# EAGLE design nine_poke_i2c (EAGLE 6.6.0)
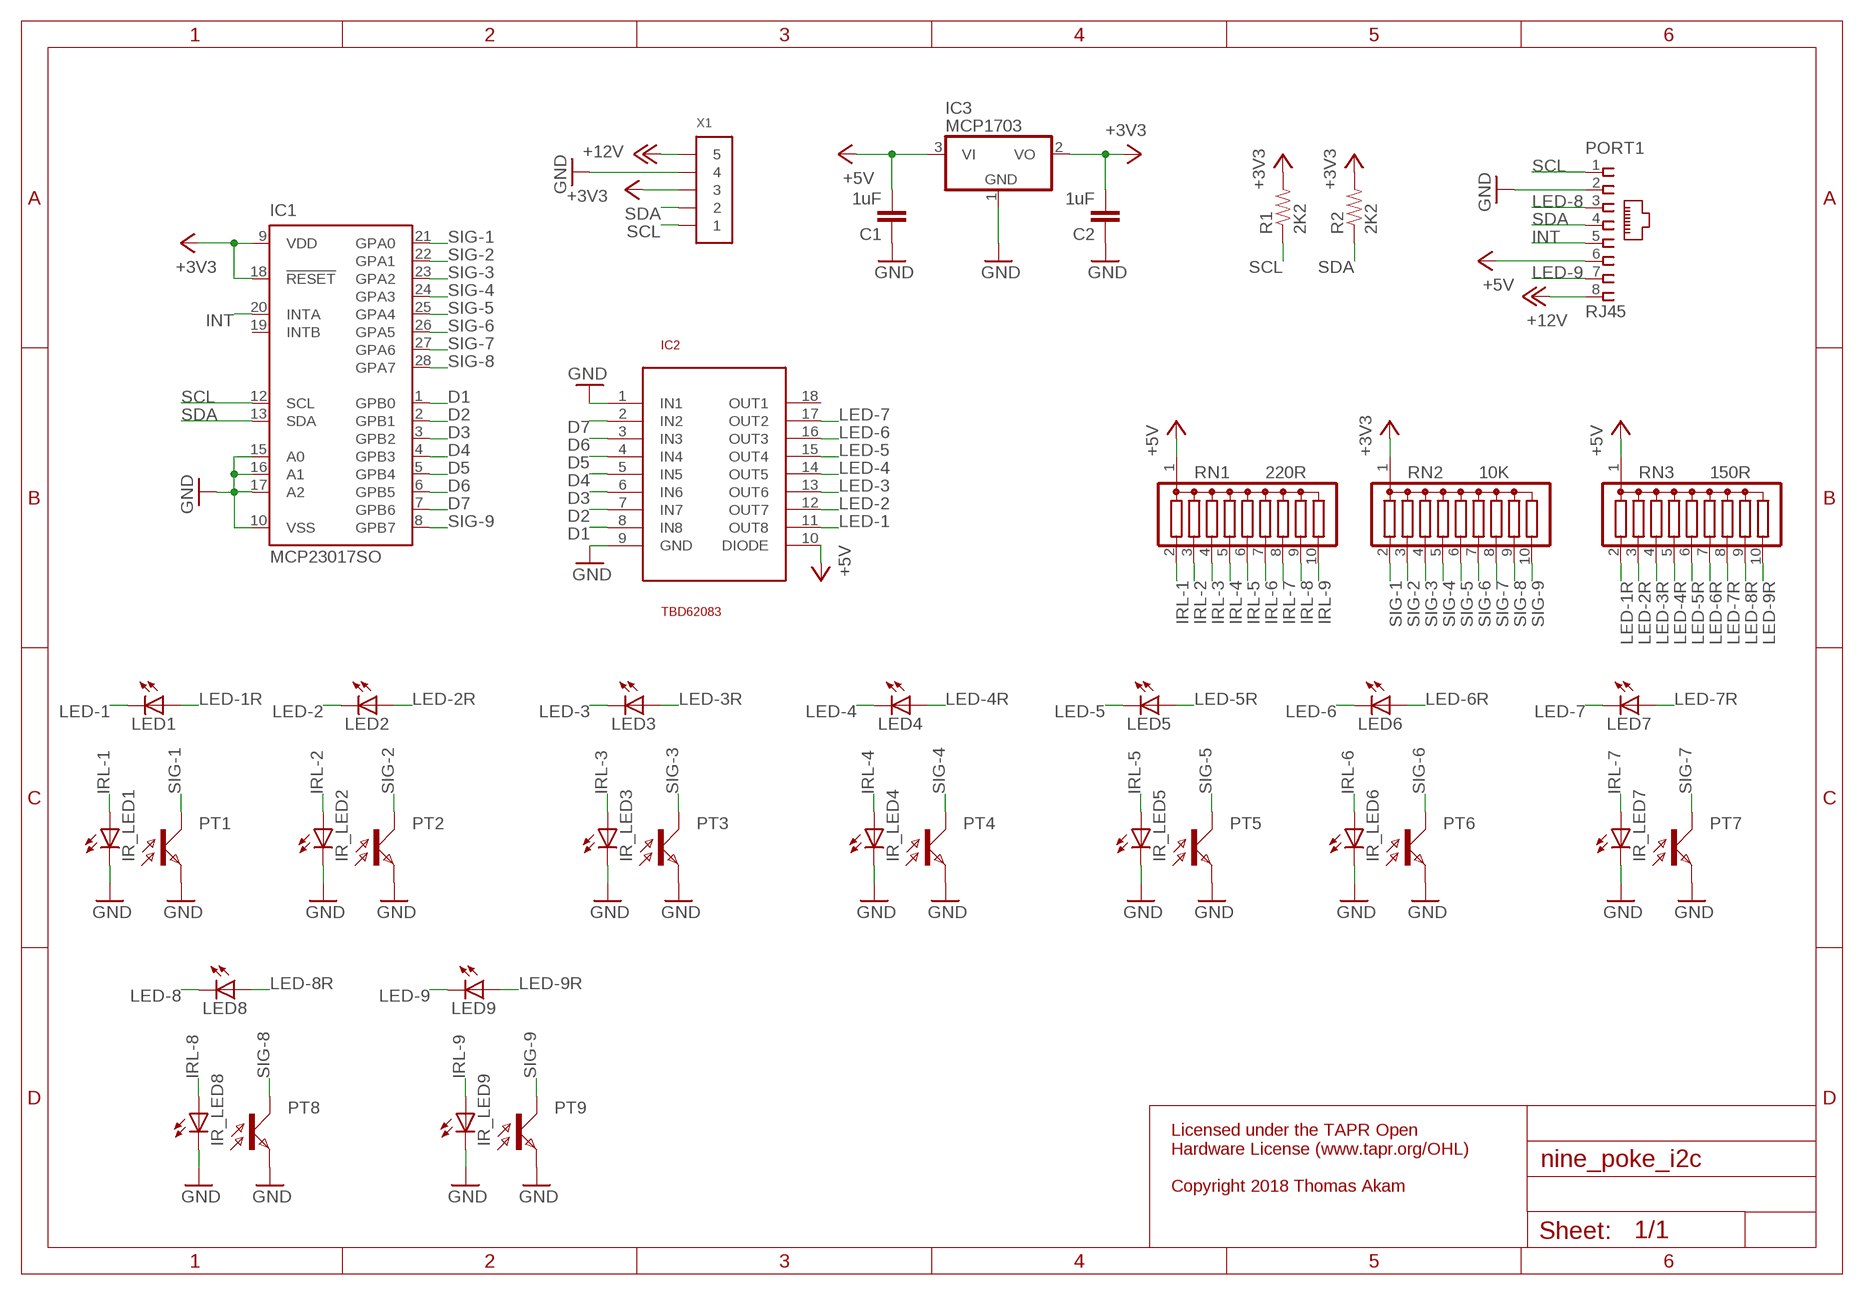
[diagram p0: schematic, sheet 1]

## Parts
C1  1uF  C-EUC0805  [C0805]
C2  1uF  C-EUC0805  [C0805]
IC1  MCP23017SO  [SO28W]
IC2  TBD62083  ULN2803  [SO18L]
IC3  MCP1703  MCP1703CB  [SOT23]
IR_LED1  LEDIRL80A  [IRL80A]
IR_LED2  LEDIRL80A  [IRL80A]
IR_LED3  LEDIRL80A  [IRL80A]
IR_LED4  LEDIRL80A  [IRL80A]
IR_LED5  LEDIRL80A  [IRL80A]
IR_LED6  LEDIRL80A  [IRL80A]
IR_LED7  LEDIRL80A  [IRL80A]
IR_LED8  LEDIRL80A  [IRL80A]
IR_LED9  LEDIRL80A  [IRL80A]
LED1  LEDSML0805  [SML0805]
LED2  LEDSML0805  [SML0805]
LED3  LEDSML0805  [SML0805]
LED4  LEDSML0805  [SML0805]
LED5  LEDSML0805  [SML0805]
LED6  LEDSML0805  [SML0805]
LED7  LEDSML0805  [SML0805]
LED8  LEDSML0805  [SML0805]
LED9  LEDSML0805  [SML0805]
PORT1  RJ45  RJ45VERTICAL  [RJ45-NO-SHIELD-VERTICAL]
PT1  LPT80A  [LPT80A]
PT2  LPT80A  [LPT80A]
PT3  LPT80A  [LPT80A]
PT4  LPT80A  [LPT80A]
PT5  LPT80A  [LPT80A]
PT6  LPT80A  [LPT80A]
PT7  LPT80A  [LPT80A]
PT8  LPT80A  [LPT80A]
PT9  LPT80A  [LPT80A]
R1  2K2  0.3OHM-1/8W-1%(0805)  [0805]
R2  2K2  0.3OHM-1/8W-1%(0805)  [0805]
RN1  220R  G09R  [SIL10]
RN2  10K  G09R  [SIL10]
RN3  150R  G09R  [SIL10]
X1  CONN_5-1-53398  [PB-53398-05]

## Nets
+3V3: C2.2 IC1.9(VDD) IC1.18(!RESET) IC3.2(VO) R1.2 R2.2 RN2.1 X1.3
+5V: C1.2 IC2.10(DIODE) IC3.3(VI) PORT1.6 RN1.1 RN3.1
+12V: PORT1.8 X1.5
D1: IC1.1(GPB0) IC2.8(IN8)
D2: IC1.2(GPB1) IC2.7(IN7)
D3: IC1.3(GPB2) IC2.6(IN6)
D4: IC1.4(GPB3) IC2.5(IN5)
D5: IC1.5(GPB4) IC2.4(IN4)
D6: IC1.6(GPB5) IC2.3(IN3)
D7: IC1.7(GPB6) IC2.2(IN2)
GND: C1.1 C2.1 IC1.10(VSS) IC1.15(A0) IC1.16(A1) IC1.17(A2) IC2.1(IN1) IC2.9(GND) IC3.1(GND) IR_LED1.K(C) IR_LED2.K(C) IR_LED3.K(C) IR_LED4.K(C) IR_LED5.K(C) IR_LED6.K(C) IR_LED7.K(C) IR_LED8.K(C) IR_LED9.K(C) PORT1.2 PT1.E PT2.E PT3.E PT4.E PT5.E PT6.E PT7.E PT8.E PT9.E X1.4
INT: IC1.20(INTA) PORT1.5
IRL-1: IR_LED1.A RN1.2
IRL-2: IR_LED2.A RN1.3
IRL-3: IR_LED3.A RN1.4
IRL-4: IR_LED4.A RN1.5
IRL-5: IR_LED5.A RN1.6
IRL-6: IR_LED6.A RN1.7
IRL-7: IR_LED7.A RN1.8
IRL-8: IR_LED8.A RN1.9
IRL-9: IR_LED9.A RN1.10
LED-1: IC2.11(OUT8) LED1.C
LED-1R: LED1.A RN3.2
LED-2: IC2.12(OUT7) LED2.C
LED-2R: LED2.A RN3.3
LED-3: IC2.13(OUT6) LED3.C
LED-3R: LED3.A RN3.4
LED-4: IC2.14(OUT5) LED4.C
LED-4R: LED4.A RN3.5
LED-5: IC2.15(OUT4) LED5.C
LED-5R: LED5.A RN3.6
LED-6: IC2.16(OUT3) LED6.C
LED-6R: LED6.A RN3.7
LED-7: IC2.17(OUT2) LED7.C
LED-7R: LED7.A RN3.8
LED-8: LED8.C PORT1.3
LED-8R: LED8.A RN3.9
LED-9: LED9.C PORT1.7
LED-9R: LED9.A RN3.10
SCL: IC1.12(SCL) PORT1.1 R1.1 X1.1
SDA: IC1.13(SDA) PORT1.4 R2.1 X1.2
SIG-1: IC1.21(GPA0) PT1.C RN2.2
SIG-2: IC1.22(GPA1) PT2.C RN2.3
SIG-3: IC1.23(GPA2) PT3.C RN2.4
SIG-4: IC1.24(GPA3) PT4.C RN2.5
SIG-5: IC1.25(GPA4) PT5.C RN2.6
SIG-6: IC1.26(GPA5) PT6.C RN2.7
SIG-7: IC1.27(GPA6) PT7.C RN2.8
SIG-8: IC1.28(GPA7) PT8.C RN2.9
SIG-9: IC1.8(GPB7) PT9.C RN2.10
Unconnected: IC1.19(INTB) IC2.18(OUT1)

## Notes on the sheet
- Licensed under the TAPR Open
  Hardware License (www.tapr.org/OHL)
  
  Copyright 2018 Thomas Akam

## Library data of the parts
C1 C2 = rcl:C-EU: CAPACITOR, European symbol
IC1 = microchip:MCP23017: http://ww1.microchip.com/downloads/en/DeviceDoc/21952a.pdf Source: http://ww1.microchip.com/downloads/en/DeviceDoc/21952a.pdf; MF: MICROCHIP; MPN: MCP23017-E/SO; OC_FARNELL: 1332087; OC_NEWARK: 31K2958
IC2 = uln2803:ULN2803
IC3 = linear:MCP1703: 250 mA, 16V, Low Quiescent Current LDO Regulator Source: http://ww1.microchip.com/downloads/en/DeviceDoc/22049b.pdf
IR_LED1-IR_LED9 LED1-LED9 = led:LED: LED OSRAM: - CHIPLED LG R971, LG N971, LY N971, LG Q971, LY Q971, LO R971, LY R971 LH N974, LH R974 LS Q976, LO Q976, LY Q976 LO Q996 - Hyper CHIPLED LW Q18S LB Q993, LB Q99A, LB R99A - SideLED LS A670, LO A670, LY A670, LG A670, LP A670 LB A673, LV A673, LT A673, LW A673 LH A674 LY A675 LS A676, LA A676, LO A676, LY A676, LW A676 LS A679, LY A679, LG A679 - Hyper Micro SIDELED® LS Y876, LA Y876, LO Y876, LY Y876 LT Y87S - SmartLED LW L88C, LW L88S LB L89C, LB L89S, LG L890 LS L89K, LO L89K, LY L89K LS L896, LA L896, LO L896, LY L896 - TOPLED LS T670, LO T670, LY T670, LG T670, LP T670 LSG T670, LSP T670, LSY T670, LOP T670, LYG T670 LG T671, LOG T671, LSG T671 LB T673, LV T673, LT T673, LW T673 LH T674 LS T676, LA T676, LO T676, LY T676, LB T676, LH T676, LSB T676, LW T676 LB T67C, LV T67C, LT T67C, LS T67K, LO T67K, LY T67K, LW E67C LS E67B, LA E67B, LO E67B, LY E67B, LB E67C, LV E67C, LT E67C LW T67C LS T679, LY T679, LG T679 LS T770, LO T770, LY T770, LG T770, LP T770 LB T773, LV T773, LT T773, LW T773 LH T774 LS E675, LA E675, LY E675, LS T675 LS T776, LA T776, LO T776, LY T776, LB T776 LHGB T686 LT T68C, LB T68C - Hyper Mini TOPLED® LB M676 - Mini TOPLED Santana® LG M470 LS M47K, LO M47K, LY M47K Source: http://www.osram.convergy.de LUXEON: - LUMILED® LXK2-PW12-R00, LXK2-PW12-S00, LXK2-PW14-U00, LXK2-PW14-V00 LXK2-PM12-R00, LXK2-PM12-S00, LXK2-PM14-U00 LXK2-PE12-Q00, LXK2-PE12-R00, LXK2-PE12-S00, LXK2-PE14-T00, LXK2-PE14-U00 LXK2-PB12-K00, LXK2-PB12-L00, LXK2-PB12-M00, LXK2-PB14-N00, LXK2-PB14-P00, LXK2-PB14-Q00 LXK2-PR12-L00, LXK2-PR12-M00, LXK2-PR14-Q00, LXK2-PR14-R00 LXK2-PD12-Q00, LXK2-PD12-R00, LXK2-PD12-S00 LXK2-PH12-R00, LXK2-PH12-S00 LXK2-PL12-P00, LXK2-PL12-Q00, LXK2-PL12-R00 Source: www.luxeon.com KINGBRIGHT: KA-3528ASYC Source: www.kingbright.com
PORT1 = con-tycoelectronics-vertical_RJ45:RJ45: CORCOM Modular RJ Jacks No Shield Source: www.tycoelectronics.com .. ENG_DS_1654001_1099_RJ_L_0507.pdf
PT1-PT9 = opto-trans-siemens:LPT80A: PHOTO TRANSISTOR; OC_FARNELL: unknown; OC_NEWARK: unknown
R1 R2 = SparkFun-Resistors:0.3OHM-1/8W-1%(0805): RES-11622; PROD_ID: RES-11622; VALUE: 0.3
RN1-RN3 = resistor-sil:G09R: SIL RESISTOR; OC_FARNELL: unknown; OC_NEWARK: unknown
X1 = pel_molex:CONN_5-1

## Board
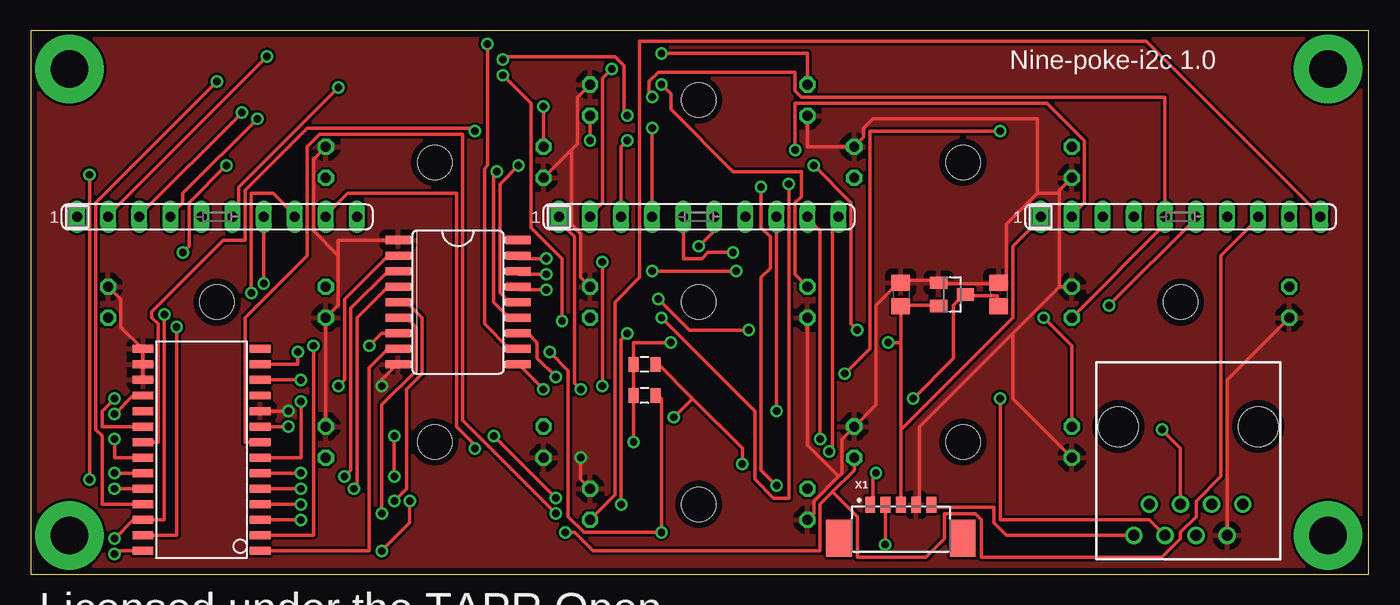
[diagram p1: board, top side]
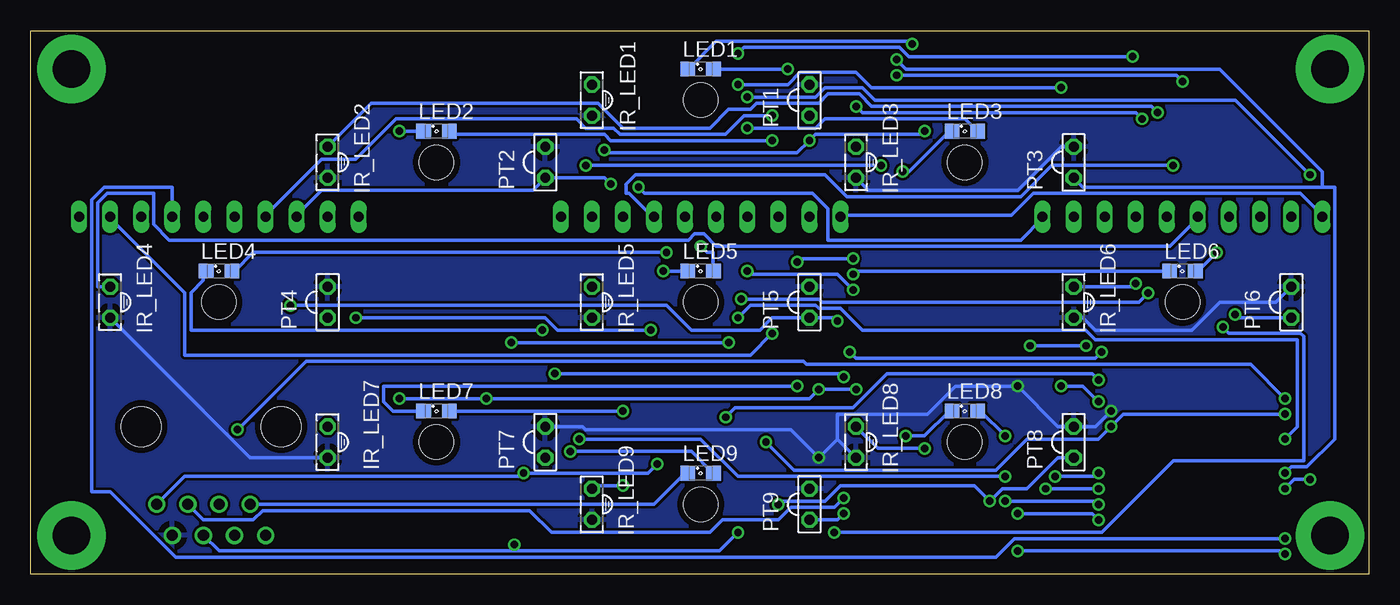
[diagram p2: board, bottom side, seen from below]

Size 109.38 x 44.41 mm. Coordinates in mm from the lower left corner, seen from the top.
Outline: 0,0 109.38,0 109.38,44.41 0,44.41 0,0
Copper layers (1*16): Top 0.035mm / dielectric 1.5mm / Bottom 0.035mm
Design rules "default *": minimum track width 12mil, minimum drill 24mil, track to track 8mil, track to pad 8mil, pad to pad 8mil, via to via 8mil, smd to smd 8mil, copper to edge 20mil, drill to drill 8mil, minimum pad ring 10mil, minimum via ring 8mil, stop-mask expansion 4mil, vias tented up to drill 0mil, thermal gap 20mil
Holes 2.8 mm at 54.61,38.73 76.2,33.66 33.02,33.66 93.98,22.23 54.61,22.23 15.24,22.23 76.2,10.79 33.02,10.79 54.61,5.71
vRestrict: area 68.5,18.9 to 82.2,24.3; area 10.2,0.6 to 17.8,18.5; area 31,15.6 to 38.6,27.4; area 12.7,29.8 to 17.1,31.1; area 52.1,29.8 to 56.5,31.1; area 91.4,29.8 to 94.6,31.1; area 80,40 to 99.1,42.5; area 48.3,12.7 to 55.9,17.8

### Footprints (pad centres in the part's own frame; a part is rotated, then mirrored left to right if it is on the bottom)
C0805 = smd 1.3 x 1.5: 1 -0.95,0; 2 0.95,0
SO28W = smd 0.65 x 1.7: 1 -7.62,-4.78; 2 -6.35,-4.78; 3 -5.08,-4.78; 4 -3.81,-4.78; 5 -2.54,-4.78; 6 -1.27,-4.78; 7 0,-4.78; 8 1.27,-4.78; 9 2.54,-4.78; 10 3.81,-4.78; 11 5.08,-4.78; 12 6.35,-4.78; 13 7.62,-4.78; 14 8.89,-4.78; 15 8.89,4.78; 16 7.62,4.78; 17 6.35,4.78; 18 5.08,4.78; 19 3.81,4.78; 20 2.54,4.78; 21 1.27,4.78; 22 0,4.78; 23 -1.27,4.78; 24 -2.54,4.78; 25 -3.81,4.78; 26 -5.08,4.78; 27 -6.35,4.78; 28 -7.62,4.78
SO18L = smd 0.66 x 2.032: 1 -5.08,-4.902; 2 -3.81,-4.902; 3 -2.54,-4.902; 4 -1.27,-4.902; 5 0,-4.902; 6 1.27,-4.902; 7 2.54,-4.902; 8 3.81,-4.902; 9 5.08,-4.902; 10 5.08,4.902; 11 3.81,4.902; 12 2.54,4.902; 13 1.27,4.902; 14 0,4.902; 15 -1.27,4.902; 16 -2.54,4.902; 17 -3.81,4.902; 18 -5.08,4.902
SOT23 = smd 1 x 1.4: 1 -0.95,-1.1; 2 0.95,-1.1; 3 0,1.1
IRL80A = drill 0.813 octagon: A 0,-1.27; K 0,1.27
SML0805 = smd 1.2 x 1.2: A 1.05,0; C -1.05,0
RJ45-NO-SHIELD-VERTICAL = drill 0.9 pad 1.4: 1 -4.445,5.08; 2 -3.175,7.62; 3 -1.905,5.08; 4 -0.635,7.62; 5 0.635,5.08; 6 1.905,7.62; 7 3.175,5.08; 8 4.445,7.62 | hole 3.251: -5.715,-1.27; 5.715,-1.27
LPT80A = drill 0.813 octagon: C 0,-1.27; E 0,1.27
0805 = smd 0.8 x 1.2: 1 -0.9,0; 2 0.9,0
SIL10 = drill 0.813 long: 1 -11.43,0; 2 -8.89,0; 3 -6.35,0; 4 -3.81,0; 5 -1.27,0; 6 1.27,0; 7 3.81,0; 8 6.35,0; 9 8.89,0; 10 11.43,0
PB-53398-05 = smd 0.8 x 1.3: 1 -2.5,1.25; 2 -1.25,1.25; 3 0,1.25; 4 1.25,1.25; 5 2.5,1.25 | smd 2.1 x 3: PAD1 -5.05,-1.5; PAD2 5.05,-1.5

### Placement (x,y rotation side)
C1  79.12,22.86 270 top
C2  71.12,22.86 270 top
IC1  13.97,9.53 90 top
IC2  34.92,22.23 270 top
IC3  75.31,22.86 270 top
IR_LED1  63.5,38.73 180 bottom
IR_LED2  85.09,33.66 180 bottom
IR_LED3  41.91,33.66 180 bottom
IR_LED4  102.87,22.23 180 bottom
IR_LED5  63.5,22.23 180 bottom
IR_LED6  24.13,22.23 180 bottom
IR_LED7  85.09,10.79 180 bottom
IR_LED8  41.91,10.79 180 bottom
IR_LED9  63.5,5.71 180 bottom
LED1  54.61,41.27 0 bottom
LED2  76.2,36.2 0 bottom
LED3  33.02,36.2 0 bottom
LED4  93.98,24.77 0 bottom
LED5  54.61,24.77 0 bottom
LED6  15.24,24.77 0 bottom
LED7  76.2,13.34 0 bottom
LED8  33.02,13.34 0 bottom
LED9  54.61,8.26 0 bottom
PORT1  94.61,10.79 180 top
PT1  45.72,38.73 0 bottom
PT2  67.31,33.66 0 bottom
PT3  24.13,33.66 0 bottom
PT4  85.09,22.23 0 bottom
PT5  45.72,22.23 0 bottom
PT6  6.35,22.23 0 bottom
PT7  67.31,10.79 0 bottom
PT8  24.13,10.79 0 bottom
PT9  45.72,5.71 0 bottom
R1  50.16,17.14 180 top
R2  50.16,14.61 180 top
RN1  15.24,29.21 0 top
RN2  93.98,29.21 0 top
RN3  54.61,29.21 0 top
X1  71.12,4.45 0 top

### Tracks (layer width: path | path; a pad name or v marks a point on that pad's centre or on a via)
+3V3  (via drill 0.61)
  Top 0.305: 71.12,18.92 C2.2 71.12,21.97 74.17,21.97 IC3.2 | 71.12,18.92 71.12,11.81 | 71.12,11.81 X1.3 | 71.12,11.81 80.26,20.95 80.26,26.8 82.55,29.08 RN2.1 | R1.2 R2.2 | v21.08,12.06 IC1.9 | v6.86,13.08 8.38,14.61 IC1.18 | v49.28,10.79 R2.2 | R2.2 | v70.1,18.92 71.12,18.92 | v52.32,18.92 49.28,18.92 R1.2 | R1.2
  Bottom 0.305: v6.86,13.08 20.07,13.08 v21.08,12.06 22.1,11.05 27.94,11.05 30.48,8.51 46.99,8.51 v49.28,10.79 | v52.32,18.92 v70.1,18.92
+5V  (via drill 0.61)
  Top 0.305: C1.2 78.99,21.97 78.99,22.73 76.45,22.73 IC3.3 76.2,22.73 75.44,21.97 75.44,17.65 v72.14,14.35 | v41.91,15.11 39.88,17.14 IC2.10 | v44.96,15.11 44.45,15.62 44.45,27.56 43.18,28.83 RN3.1 | PORT1.6 91.44,4.45 79.25,4.45 v79.25,14.35
  Bottom 0.305: v41.91,15.11 v44.96,15.11 45.72,14.35 v72.14,14.35 v79.25,14.35 | RN1.1 3.81,29.34 5.59,31.11 27.43,31.11 29.21,29.34 43.18,29.34 RN3.1
+12V
  Top 0.305: PORT1.8 79.76,3.17 78.74,4.19 78.74,5.46 73.66,5.46 X1.5
D1
  Top 0.305: IC1.1 27.69,1.91 27.69,16.89 29.21,18.41 IC2.8
D2  (via drill 0.61)
  Top 0.305: IC1.2 23.11,3.17 v23.11,18.67 | v27.69,18.67 28.7,19.68 IC2.7
  Bottom 0.305: v27.69,18.67 v23.11,18.67
D3  (via drill 0.61)
  Top 0.305: v22.1,4.45 IC1.3 | v28.7,4.95 28.7,13.84 31.5,16.64 31.5,20.19 30.73,20.95 IC2.6
  Bottom 0.305: v22.1,4.45 22.61,4.95 v28.7,4.95
D4  (via drill 0.61)
  Top 0.305: v22.1,5.71 IC1.4 | v29.72,5.97 30.73,6.99 30.73,15.11 32,16.38 32,20.95 30.73,22.23 IC2.5
  Bottom 0.305: v22.1,5.71 22.35,5.97 v29.72,5.97
D5  (via drill 0.61)
  Top 0.305: v22.1,6.99 IC1.5 | v26.42,6.99 26.67,7.24 26.67,20.95 29.21,23.5 IC2.4
  Bottom 0.305: v26.42,6.99 v22.1,6.99
D6  (via drill 0.61)
  Top 0.305: v22.1,8.26 IC1.6 | v25.65,8 26.16,8.51 26.16,21.72 29.21,24.77 IC2.3
  Bottom 0.305: v22.1,8.26 22.35,8 v25.65,8
D7  (via drill 0.61)
  Top 0.305: IC1.7 22.1,9.53 v22.1,14.1 | v25.15,15.37 25.65,15.88 25.65,22.48 29.21,26.04 IC2.2
  Bottom 0.305: v22.1,14.1 23.37,15.37 v25.15,15.37
GND  (via drill 0.61)
  Top 0.305: v21.08,13.34 IC1.10 | v28.7,15.37 28.7,15.88 29.97,17.14 IC2.9 | PT9.E 44.96,7.75 v44.96,9.53 | 44.2,34.67 44.7,35.18 44.7,38.99 PT1.E | 44.2,34.67 IR_LED3.K | PT5.E 44.96,24.26 44.96,27.81 44.2,28.57 44.2,34.67 | 9.14,17.14 9.14,15.88 IC1.17 | 9.14,17.14 9.14,18.41 | 9.14,17.14 IC1.16 | 9.14,18.41 7.37,20.19 7.37,22.48 PT6.E | 9.14,18.41 IC1.15 | IC2.1 25.15,27.3 25.15,26.04 | 25.15,26.04 25.15,21.97 IR_LED6.K PT8.E | PT3.E 23.11,33.91 23.11,28.07 25.15,26.04 | IR_LED4.K 97.79,15.88 PORT1.2 | IR_LED9.K 64.01,4.95 64.01,5.97 66.04,8 | 66.04,8 66.29,8.26 66.29,11.05 PT7.E 69.09,13.84 69.09,21.97 71.12,24 | IR_LED5.K 63.5,10.54 66.04,8 | IR_LED1.K 63.5,34.92 PT2.E 68.07,35.69 68.07,36.45 68.83,37.21 82.3,37.21 82.3,31.11 | 71.12,24 74.17,24 IC3.1 74.42,23.75 78.99,23.75 C1.1 79.25,24 79.76,24.51 79.76,28.57 82.3,31.11 | X1.4 72.64,5.97 72.64,12.06 80.26,19.68 | 84.07,23.5 80.26,19.68 | PT4.E 84.07,23.5 | IR_LED7.K 80.26,14.35 80.26,19.68 | IR_LED2.K 84.07,31.37 84.07,31.11 | 84.07,23.5 84.07,31.11 | 84.07,31.11 82.3,31.11 | 71.12,24 C2.1
  Bottom 0.305: v21.08,13.34 22.35,12.06 PT8.E 25.4,12.06 v28.7,15.37 33.78,15.37 36.07,13.08 43.43,13.08 43.43,11.05 | 43.43,11.05 IR_LED8.K | 43.43,11.05 v44.96,9.53 47.24,11.81 64.01,11.81 64.26,12.06 PT7.E | PT6.E 7.62,22.23 12.19,22.23 14.48,19.94 22.35,19.94 23.37,20.95 IR_LED6.K | IR_LED3.K 40.89,31.37 28.7,31.37 25.15,34.92 PT3.E | IR_LED4.K 91.44,9.53 IR_LED7.K
  pour Bottom: 0,0 0,44.45 109.22,44.45 109.22,0
  pour Top: 0,0 109.22,0 109.22,44.45 0,44.45
INT  (via drill 0.61)
  Top 0.305: IC1.20 5.84,12.06 5.84,13.34 v6.86,14.35 | v92.46,11.81 93.98,10.29 PORT1.5
  Bottom 0.305: v6.86,14.35 9.65,17.14 45.97,17.14 46.23,17.4 86.87,17.4 v92.46,11.81
IRL-1  (via drill 0.61)
  Top 0.305: v19.3,42.29 6.35,29.34 RN1.2 | v51.56,42.55 63.5,42.55 IR_LED1.A
  Bottom 0.305: v19.3,42.29 37.59,42.29 38.35,43.05 51.05,43.05 v51.56,42.55
IRL-2  (via drill 0.61)
  Top 0.305: v17.27,37.72 8.89,29.34 RN1.3
  Bottom 0.305: v17.27,37.72 17.78,38.23 40.64,38.23 41.66,39.24 44.2,39.24 44.96,38.48 50.04,38.48 50.55,37.97 52.32,37.97 53.85,36.45 60.96,36.45 62.99,38.48 81.53,38.48 IR_LED2.A
IRL-3  (via drill 0.61)
  Top 0.305: v18.54,37.21 12.45,31.11 12.45,30.35 11.43,29.34 RN1.4 | IR_LED3.A v41.91,38.23
  Bottom 0.305: v18.54,37.21 19.05,37.72 41.4,37.72 v41.91,38.23
IRL-4
  Bottom 0.305: IR_LED4.A 103.89,23.5 103.89,30.35 103.12,31.11 99.31,31.11 99.31,28.57 98.04,27.3 55.63,27.3 55.12,27.81 54.36,27.81 53.34,26.8 16.26,26.8 13.97,29.08 RN1.5
IRL-5  (via drill 0.61)
  Top 0.305: v25.15,39.75 17.02,31.62 17.02,29.84 16.51,29.34 RN1.6 | v51.56,40.01 52.32,39.24 52.32,37.97 57.4,32.89 62.99,32.89 62.99,30.86 62.48,30.35 62.48,24.51 IR_LED5.A
  Bottom 0.305: v25.15,39.75 40.64,39.75 41.91,41.02 46.48,41.02 47.5,40.01 v51.56,40.01
IRL-6  (via drill 0.61)
  Top 0.305: v19.05,23.75 RN1.7
  Bottom 0.305: v19.05,23.75 19.3,23.5 IR_LED6.A
IRL-7  (via drill 0.61)
  Top 0.305: v18.03,22.99 18.03,31.11 19.81,31.11 21.59,29.34 RN1.8 | v51.31,22.48 53.85,19.94 v58.67,19.94 | v82.8,20.95 85.09,18.67 IR_LED7.A
  Bottom 0.305: v18.03,22.99 18.8,22.23 44.7,22.23 44.96,22.48 v51.31,22.48 | v58.67,19.94 66.29,19.94 67.31,20.95 v82.8,20.95
IRL-8  (via drill 0.61)
  Top 0.305: v36.32,10.29 36.32,10.54 34.8,12.06 34.8,31.11 25.91,31.11 24.13,29.34 RN1.9
  Bottom 0.305: v36.32,10.29 40.13,10.29 IR_LED8.A
IRL-9  (via drill 0.61)
  Top 0.305: v60.96,7.24 59.69,8.51 59.69,24.26 60.45,25.02 60.45,27.56 59.69,28.32 v59.69,31.62
  Bottom 0.305: IR_LED9.A 63.25,7.24 v60.96,7.24 | v59.69,31.62 59.18,31.11 45.47,31.11 44.2,29.84 44.2,27.3 28.45,27.3 26.67,29.08 RN1.10
LED-1  (via drill 0.61)
  Top 0.305: v37.34,43.31 37.34,33.4 37.08,33.15 37.08,20.45 39.12,18.41 IC2.11
  Bottom 0.305: v37.34,43.31 37.59,43.56 53.34,43.56 55.63,41.27 LED1.C
LED-1R  (via drill 0.61)
  Top 0.305: v47.5,41.27 46.74,40.51 46.74,30.35 45.72,29.34 RN3.2
  Bottom 0.305: v47.5,41.27 LED1.A
LED-2  (via drill 0.61)
  Top 0.305: v79.25,36.2 68.58,36.2 68.58,18.41 v66.55,16.38 | v42.93,16.13 41.4,17.65 41.4,18.92 40.64,19.68 IC2.12
  Bottom 0.305: v79.25,36.2 LED2.C | v66.55,16.38 43.18,16.38 v42.93,16.13
LED-2R  (via drill 0.61)
  Top 0.305: v48.77,35.43 48.26,34.92 RN3.3
  Bottom 0.305: v48.77,35.43 61.98,35.43 62.48,35.94 74.68,35.94 74.93,36.2 LED2.A
LED-3  (via drill 0.61)
  Top 0.305: v38.1,32.89 37.85,32.64 37.85,22.23 39.12,20.95 IC2.13
  Bottom 0.305: v38.1,32.89 37.59,32.89 34.29,36.2 LED3.C
LED-3R  (via drill 0.61)
  Top 0.305: RN3.4 v50.8,36.45
  Bottom 0.305: v50.8,36.45 45.21,36.45 44.45,37.21 33.02,37.21 32,36.2 LED3.A
LED-4  (via drill 0.61)
  Top 0.305: v67.56,19.94 67.06,20.45 67.06,30.35 v64.01,33.4 | v39.88,33.4 38.35,31.88 38.35,22.99 39.12,22.23 IC2.14
  Bottom 0.305: v67.56,19.94 96.27,19.94 96.27,22.99 95.25,24 95.25,24.77 LED4.C | v39.88,33.4 v64.01,33.4
LED-4R  (via drill 0.61)
  Top 0.305: v57.4,26.29 55.37,26.29 54.86,25.78 53.34,25.78 RN3.5
  Bottom 0.305: v57.4,26.29 91.19,26.29 92.71,24.77 LED4.A
LED-5  (via drill 0.61)
  Top 0.305: v50.8,24.77 v57.66,24.77 | v42.16,23.24 39.88,23.24 39.88,23.5 IC2.15
  Bottom 0.305: v57.66,24.77 LED5.C | v50.8,24.77 50.55,24.51 43.43,24.51 v42.16,23.24
LED-5R  (via drill 0.61)
  Top 0.305: v54.61,26.8 55.88,28.07 RN3.6
  Bottom 0.305: v54.61,26.8 54.1,26.29 53.59,26.29 53.59,24.77 LED5.A
LED-6  (via drill 0.61)
  Top 0.305: v42.16,24.51 39.88,24.51 39.88,24.77 IC2.16
  Bottom 0.305: LED6.C 41.91,24.77 v42.16,24.51
LED-6R  (via drill 0.61)
  Top 0.305: v12.45,26.29 12.95,26.8 12.95,30.35 v16,33.4
  Bottom 0.305: v12.45,26.29 13.97,24.77 LED6.A | v16,33.4 25.91,33.4 28.45,30.86 42.67,30.86 44.45,32.64 59.94,32.64 60.71,31.88 60.71,31.11 60.45,31.11 58.67,29.34 58.42,29.34 RN3.7
LED-7  (via drill 0.61)
  Top 0.305: v46.74,25.53 v46.74,15.37 | v42.16,25.78 39.88,25.78 39.88,26.04 IC2.17
  Bottom 0.305: LED7.C 79.76,13.34 80.52,14.1 80.52,15.37 v46.74,15.37 | v46.74,25.53 46.48,25.78 v42.16,25.78
LED-7R  (via drill 0.61)
  Top 0.305: RN3.8 v60.96,13.34
  Bottom 0.305: v60.96,13.34 LED7.A
LED-8  (via drill 0.61)
  Top 0.305: v42.93,6.22 v37.85,11.3
  Bottom 0.305: v37.85,11.3 36.32,11.3 34.29,13.34 LED8.C | v42.93,6.22 43.69,5.46 47.24,5.46 48.26,4.45 52.83,4.45 53.85,3.43 66.8,3.43 68.58,5.21 90.42,5.21 91.19,4.45 95.25,4.45 PORT1.3
LED-8R  (via drill 0.61)
  Top 0.305: v29.72,8 v29.72,11.3 | v64.52,11.05 64.52,28.07 63.5,29.08 RN3.9
  Bottom 0.305: v29.72,11.3 31.75,13.34 LED8.A | v29.72,8 51.56,8 54.61,11.05 v64.52,11.05
LED-9
  Bottom 0.305: PORT1.7 58.42,5.71 55.88,8.26 LED9.C
LED-9R  (via drill 0.61)
  Top 0.305: v65.28,10.03 65.53,10.29 65.53,28.57 66.04,29.08 RN3.10
  Bottom 0.305: v65.28,10.03 55.37,10.03 53.59,8.26 LED9.A
N$1  (via drill 3.05 pad 5.59)
  other vias: 106.05,41.27
N$2  (via drill 3.05 pad 5.59)
  other vias: 3.17,3.17
N$3  (via drill 3.05 pad 5.59)
  other vias: 3.17,41.27
N$4  (via drill 3.05 pad 5.59)
  other vias: 106.05,3.17
SCL  (via drill 0.61)
  Top 0.305: 54.1,14.35 58.17,10.29 v58.17,9.02 | 54.1,14.35 51.31,17.14 R1.1 | v69.09,8.26 68.83,8 68.83,5.71 X1.1 | v22.1,15.88 IC1.12 | 54.1,14.35 v52.58,12.83
  Bottom 0.305: v58.17,9.02 58.93,8.26 v69.09,8.26 69.34,8 96.77,8 PORT1.1 | v22.1,15.88 22.61,16.38 39.37,16.38 42.16,13.59 51.82,13.59 v52.58,12.83
SDA  (via drill 0.61)
  Top 0.305: R2.1 51.31,14.61 51.56,14.35 v51.56,3.43 45.21,3.43 43.94,4.7 43.94,16.64 v42.42,18.16 | v69.85,2.41 69.85,5.46 X1.2 | IC1.13 21.84,17.14 v21.84,18.16
  Bottom 0.305: v51.56,3.43 53.09,1.91 69.85,1.91 | 69.85,1.91 93.98,1.91 PORT1.4 | 69.85,1.91 v69.85,2.41 | v21.84,18.16 22.35,17.65 41.91,17.65 v42.42,18.16
SIG-1  (via drill 0.61)
  Top 0.305: IC1.21 10.41,10.79 10.41,20.45 9.91,20.95 9.91,21.46 15.75,27.3 17.53,27.3 17.53,31.37 22.61,36.45 36.32,36.45 v36.32,36.2 | PT1.C v45.72,35.43 | v62.48,34.67 62.48,38.48 83.06,38.48 86.11,35.43 86.11,30.35 85.09,29.34 RN2.2
  Bottom 0.305: v36.32,36.2 36.58,35.94 45.21,35.94 v45.72,35.43 46.74,34.42 62.23,34.42 v62.48,34.67
SIG-2  (via drill 0.61)
  Top 0.305: IC1.22 6.86,9.53 v6.86,11.05 | v51.56,20.95 59.18,13.34 59.18,7.75 60.71,6.22 61.98,6.22 v61.98,31.88
  Bottom 0.305: v6.86,11.05 5.84,12.06 5.84,19.18 22.35,19.18 23.11,19.94 41.4,19.94 43.18,21.72 44.96,21.72 45.21,21.97 50.55,21.97 v51.56,20.95 | v61.98,31.88 62.48,32.38 PT2.C 68.33,31.37 85.6,31.37 87.63,29.34 RN2.3
SIG-3  (via drill 0.61)
  Top 0.305: v6.86,8.26 IC1.23 | v48.77,37.47 48.51,37.72 48.51,41.53 47.75,42.29 38.61,42.29 v38.61,42.04
  Bottom 0.305: v6.86,8.26 6.35,8.76 5.08,8.76 2.79,11.05 2.79,31.62 3.81,31.62 | 3.81,31.62 23.37,31.62 PT3.C | v48.77,37.47 51.05,37.47 52.58,35.94 61.21,35.94 61.72,36.45 64.01,36.45 64.77,37.21 79.5,37.21 82.8,33.91 85.6,33.91 90.17,29.34 RN2.4 | v38.61,42.04 37.85,41.27 12.19,41.27 3.81,32.89 3.81,31.62
SIG-4  (via drill 0.61)
  Top 0.305: v6.86,6.99 IC1.24 | v4.83,32.64 v4.83,7.75 | v50.8,38.99 50.55,39.24 50.55,40.26 51.31,41.02 62.48,41.02 62.48,39.5 62.99,38.99 92.71,38.99 RN2.5 92.71,28.57 PT4.C
  Bottom 0.305: v6.86,6.99 6.1,7.75 v4.83,7.75 | v4.83,32.64 10.92,38.73 40.39,38.73 41.4,39.75 44.45,39.75 45.21,38.99 v50.8,38.99
SIG-5  (via drill 0.61)
  Top 0.305: IC1.25 5.84,5.71 5.84,11.3 5.33,11.81 5.33,30.35 v15.24,40.26 | v38.61,40.77 40.89,38.48 40.89,28.32 43.43,25.78 v43.43,20.7 | v88.14,21.97 95.25,29.08 RN2.6
  Bottom 0.305: v15.24,40.26 15.75,40.77 v38.61,40.77 | v43.43,20.7 43.69,20.95 PT5.C 48.77,20.95 49.78,19.94 55.37,19.94 57.4,21.97 v88.14,21.97
SIG-6  (via drill 0.61)
  Top 0.305: v10.92,21.21 10.92,4.45 IC1.26 8.38,4.45 v6.86,2.92
  Bottom 0.305: v10.92,21.21 10.67,20.95 PT6.C | RN2.7 97.79,31.62 103.38,31.62 104.39,30.61 104.39,6.73 102.87,6.73 97.54,1.4 30.48,1.4 28.96,2.92 v6.86,2.92
SIG-7  (via drill 0.61)
  Top 0.305: IC1.27 11.94,3.17 v11.94,20.19 | v43.69,3.43 44.45,3.43 45.97,1.91 64.52,1.91 64.52,5.71 65.53,6.73 | 65.53,6.73 67.31,8.51 PT7.C | 65.53,6.73 67.56,4.7 67.56,1.4 73.15,1.4 74.68,2.92 74.68,4.95 77.22,4.95 77.72,4.45 77.72,1.4 92.46,1.4 93.98,2.92 93.98,3.43 95.25,4.7 95.25,5.97 97.28,8 97.28,26.04 100.33,29.08 RN2.8
  Bottom 0.305: v11.94,20.19 11.43,19.68 5.59,19.68 5.33,19.43 5.33,9.27 16,9.27 21.84,3.43 v43.69,3.43
SIG-8  (via drill 0.61)
  Top 0.305: IC1.28 6.86,1.91 v6.86,1.65 | v28.7,1.91 30.99,4.19 v30.99,5.97 | v48.77,19.68 48.26,19.18 v48.26,5.71
  Bottom 0.305: v6.86,1.65 7.11,1.91 v28.7,1.91 | PT8.C 25.4,9.53 27.94,6.99 29.97,6.99 v30.99,5.97 32.26,7.24 43.18,7.24 44.45,5.97 48.01,5.97 v48.26,5.71 | v48.77,19.68 50.55,17.91 96.77,17.91 96.77,22.99 102.87,29.08 RN2.9
SIG-9  (via drill 0.61)
  Top 0.305: IC1.8 17.53,10.79 17.53,20.95 22.61,26.04 22.61,34.92 23.62,35.94 35.31,35.94 35.31,12.57 v42.93,4.95 | PT9.C 47.75,6.48 47.75,22.23 49.78,24.26 49.78,43.56 91.19,43.56 105.41,29.34 RN2.10
  Bottom 0.305: v42.93,4.95 43.43,4.45 PT9.C

### Text on the board
tPlace: Nine-poke-i2c 1.0 | Licensed under the TAPR Open / Hardware License (www.tapr.org/OHL) / / Copyright 2018 Thomas Akam